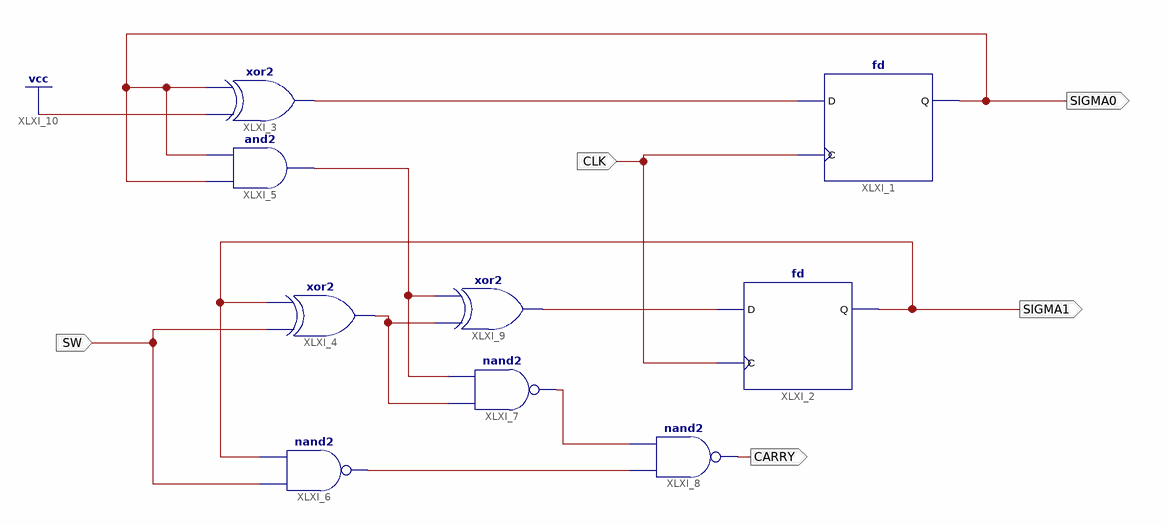
[diagram p0: schematic sheet 1]
// Xilinx ISE schematic UPDOWN_CNT2.sch (spartan6) as structural Verilog: 9 symbols, 5 ports
module UPDOWN_CNT2 (
  input  CLK,
  input  SW,
  output SIGMA0,
  output SIGMA1,
  output CARRY
);

  wire XLXN_5, XLXN_9, XLXN_10, XLXN_23, XLXN_25, XLXN_26;

  fd XLXI_1 (.C(CLK), .D(XLXN_5), .Q(SIGMA0));
  fd XLXI_2 (.C(CLK), .D(XLXN_26), .Q(SIGMA1));
  xor XLXI_3 (XLXN_5, 1'b1, SIGMA0);
  xor XLXI_4 (XLXN_9, SW, SIGMA1);
  and XLXI_5 (XLXN_10, SIGMA0, SIGMA0);
  nand XLXI_6 (XLXN_25, SW, SIGMA1);
  nand XLXI_7 (XLXN_23, XLXN_9, XLXN_10);
  nand XLXI_8 (CARRY, XLXN_25, XLXN_23);
  xor XLXI_9 (XLXN_26, XLXN_9, XLXN_10);
endmodule
